# EAGLE design main (EAGLE 8.3.1)
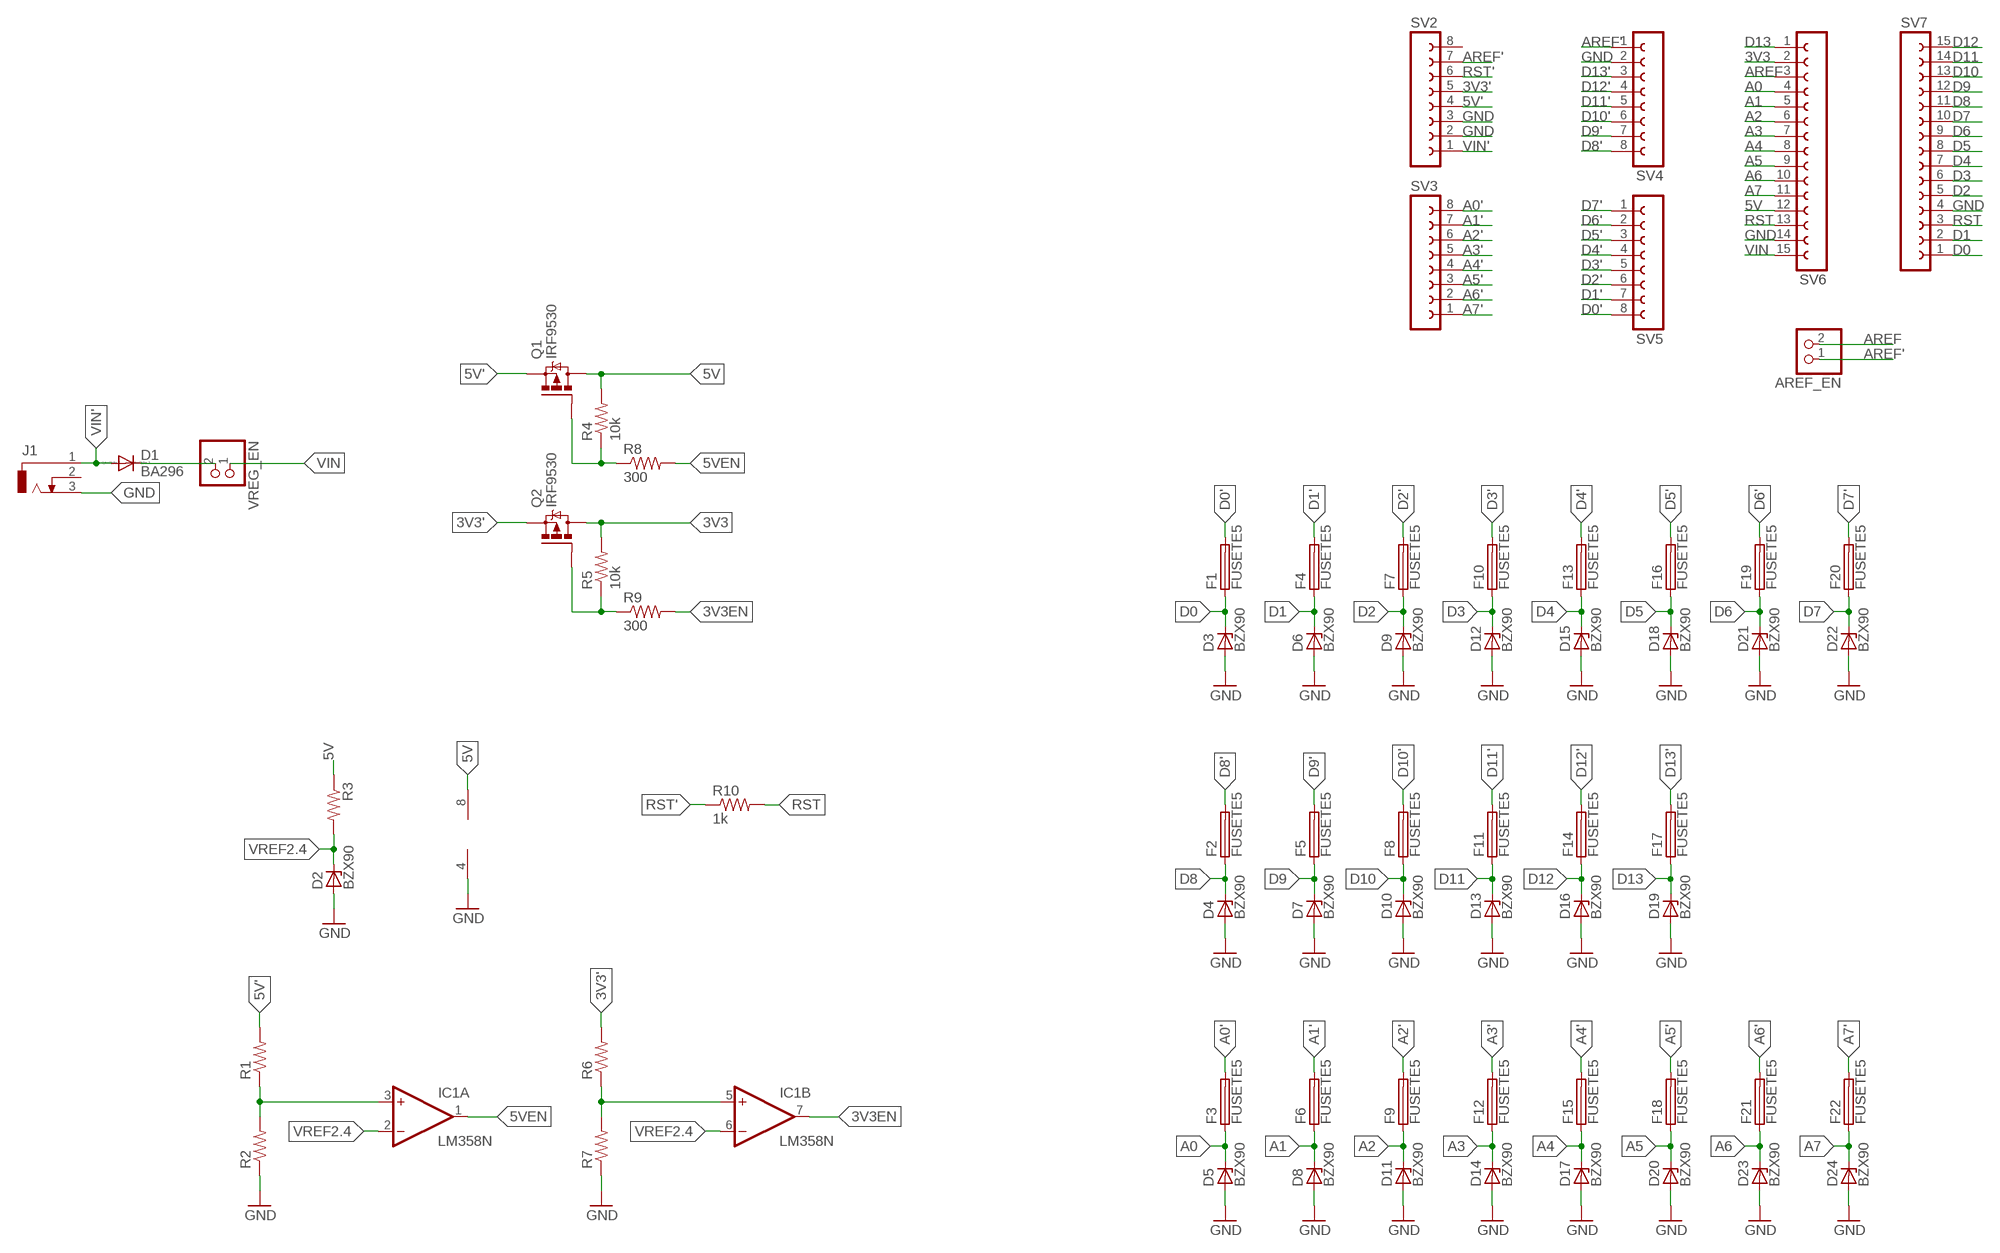
[diagram p0: schematic, sheet 1]

## Parts
AREF_EN  PINHD-1X2  [1X02]
D1  BA296  [P2-15]
D2  BZX90  [DO34Z7]
D3  BZX90  [DO34Z7]
D4  BZX90  [DO34Z7]
D5  BZX90  [DO34Z7]
D6  BZX90  [DO34Z7]
D7  BZX90  [DO34Z7]
D8  BZX90  [DO34Z7]
D9  BZX90  [DO34Z7]
D10  BZX90  [DO34Z7]
D11  BZX90  [DO34Z7]
D12  BZX90  [DO34Z7]
D13  BZX90  [DO34Z7]
D14  BZX90  [DO34Z7]
D15  BZX90  [DO34Z7]
D16  BZX90  [DO34Z7]
D17  BZX90  [DO34Z7]
D18  BZX90  [DO34Z7]
D19  BZX90  [DO34Z7]
D20  BZX90  [DO34Z7]
D21  BZX90  [DO34Z7]
D22  BZX90  [DO34Z7]
D23  BZX90  [DO34Z7]
D24  BZX90  [DO34Z7]
F1  FUSETE5  [TE5]
F2  FUSETE5  [TE5]
F3  FUSETE5  [TE5]
F4  FUSETE5  [TE5]
F5  FUSETE5  [TE5]
F6  FUSETE5  [TE5]
F7  FUSETE5  [TE5]
F8  FUSETE5  [TE5]
F9  FUSETE5  [TE5]
F10  FUSETE5  [TE5]
F11  FUSETE5  [TE5]
F12  FUSETE5  [TE5]
F13  FUSETE5  [TE5]
F14  FUSETE5  [TE5]
F15  FUSETE5  [TE5]
F16  FUSETE5  [TE5]
F17  FUSETE5  [TE5]
F18  FUSETE5  [TE5]
F19  FUSETE5  [TE5]
F20  FUSETE5  [TE5]
F21  FUSETE5  [TE5]
F22  FUSETE5  [TE5]
IC1  LM358N  [DIL08]
J1  DCJ0303  [DCJ0303]
Q1  IRF9530  [TO220BV]
Q2  IRF9530  [TO220BV]
R1  R-US_0204/7  [0204/7]
R2  R-US_0204/7  [0204/7]
R3  R-US_0204/7  [0204/7]
R4  10k  R-US_0204/7  [0204/7]
R5  10k  R-US_0204/7  [0204/7]
R6  R-US_0204/7  [0204/7]
R7  R-US_0204/7  [0204/7]
R8  300  R-US_0204/7  [0204/7]
R9  300  R-US_0204/7  [0204/7]
R10  1k  R-US_0204/7  [0204/7]
SV2  FE08-1  [FE08]
SV3  FE08-1  [FE08]
SV4  FE08-1  [FE08]
SV5  FE08-1  [FE08]
SV6  FE15-1  [FE15]
SV7  FE15-1  [FE15]
VREG_EN  PINHD-1X2  [1X02]

## Nets
3V3: Q2.D R5.2 SV6.2
3V3': Q2.S R6.2 SV2.5
3V3EN: IC1.7(B:OUT) R9.2
5V: IC1.8(P:V+) Q1.D R3.1 R4.2 SV6.12
5V': Q1.S R1.2 SV2.4
5VEN: IC1.1(A:OUT) R8.2
A0: D5.C F3.1 SV6.4
A0': F3.2 SV3.8
A1: D8.C F6.1 SV6.5
A1': F6.2 SV3.7
A2: D11.C F9.1 SV6.6
A2': F9.2 SV3.6
A3: D14.C F12.1 SV6.7
A3': F12.2 SV3.5
A4: D17.C F15.1 SV6.8
A4': F15.2 SV3.4
A5: D20.C F18.1 SV6.9
A5': F18.2 SV3.3
A6: D23.C F21.1 SV6.10
A6': F21.2 SV3.2
A7: D24.C F22.1 SV6.11
A7': F22.2 SV3.1
AREF: AREF_EN.2 SV6.3
AREF': AREF_EN.1 SV2.7 SV4.1
D0: D3.C F1.1 SV7.1
D0': F1.2 SV5.8
D1: D6.C F4.1 SV7.2
D1': F4.2 SV5.7
D2: D9.C F7.1 SV7.5
D2': F7.2 SV5.6
D3: D12.C F10.1 SV7.6
D3': F10.2 SV5.5
D4: D15.C F13.1 SV7.7
D4': F13.2 SV5.4
D5: D18.C F16.1 SV7.8
D5': F16.2 SV5.3
D6: D21.C F19.1 SV7.9
D6': F19.2 SV5.2
D7: D22.C F20.1 SV7.10
D7': F20.2 SV5.1
D8: D4.C F2.1 SV7.11
D8': F2.2 SV4.8
D9: D7.C F5.1 SV7.12
D9': F5.2 SV4.7
D10: D10.C F8.1 SV7.13
D10': F8.2 SV4.6
D11: D13.C F11.1 SV7.14
D11': F11.2 SV4.5
D12: D16.C F14.1 SV7.15
D12': F14.2 SV4.4
D13: D19.C F17.1 SV6.1
D13': F17.2 SV4.3
GND: D2.A D3.A D4.A D5.A D6.A D7.A D8.A D9.A D10.A D11.A D12.A D13.A D14.A D15.A D16.A D17.A D18.A D19.A D20.A D21.A D22.A D23.A D24.A IC1.4(P:V-) J1.3 R2.1 R7.1 SV2.2 SV2.3 SV4.2 SV6.14 SV7.4
N$2: D1.C VREG_EN.2
N$3: Q2.G R5.1 R9.1
N$4: Q1.G R4.1 R8.1
N$6: IC1.3(A:+IN) R1.1 R2.2
N$7: IC1.5(B:+IN) R6.1 R7.2
RST: R10.2 SV6.13 SV7.3
RST': R10.1 SV2.6
VIN: SV6.15 VREG_EN.1
VIN': D1.A J1.1 SV2.1
VREF2.4: D2.C IC1.2(A:-IN) IC1.6(B:-IN) R3.2
Unconnected: J1.2 SV2.8

## Library data of the parts
AREF_EN VREG_EN = pinhead:PINHD-1X2: PIN HEADER
D1 = diode:BA296: DIODE
D2-D24 = diode:BZX90: Z DIODE
F1-F22 = fuse:FUSE: Fuse; OC_FARNELL: unknown; OC_NEWARK: unknown
IC1 = linear:LM358: OP AMP also LM158; LM258; LM2904 Source: http://cache.national.com/ds/LM/LM158.pdf
J1 = con-jack:DCJ0303: DC POWER JACK Source: DCJ0303.pdf; OC_FARNELL: unknown; OC_NEWARK: unknown
Q1 Q2 = transistor-power:IRF9530: P-CHANNEL HEXFET POWER-MOS-FET Source: http://www.irf.com/product-info/datasheets/data/irf9530.pdf
R1-R10 = rcl:R-US_: RESISTOR, American symbol
SV2-SV5 = con-lsta:FE08-1: FEMALE HEADER; OC_FARNELL: unknown; OC_NEWARK: unknown
SV6 SV7 = con-lsta:FE15-1: FEMALE HEADER; OC_FARNELL: unknown; OC_NEWARK: unknown

## Board
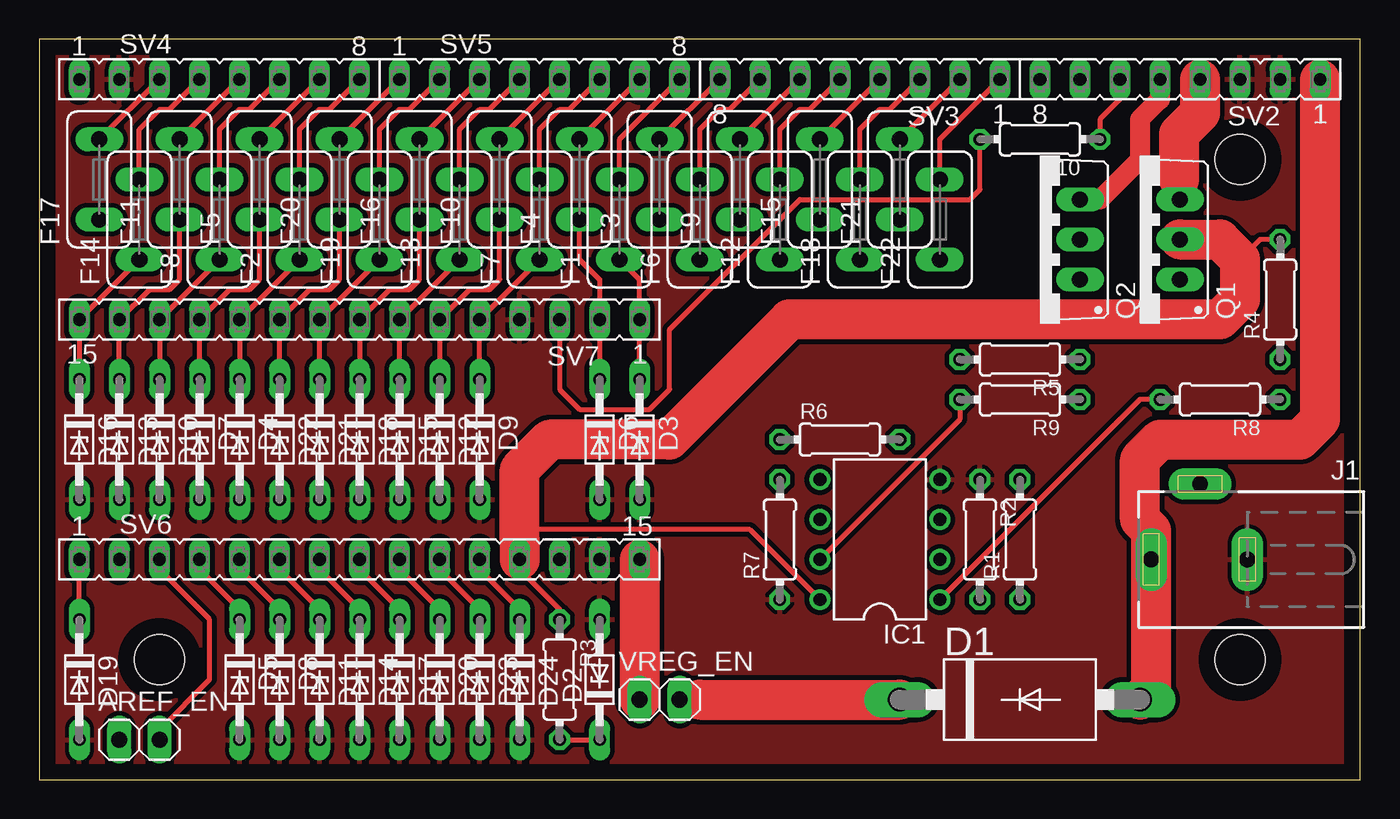
[diagram p1: board, top side]
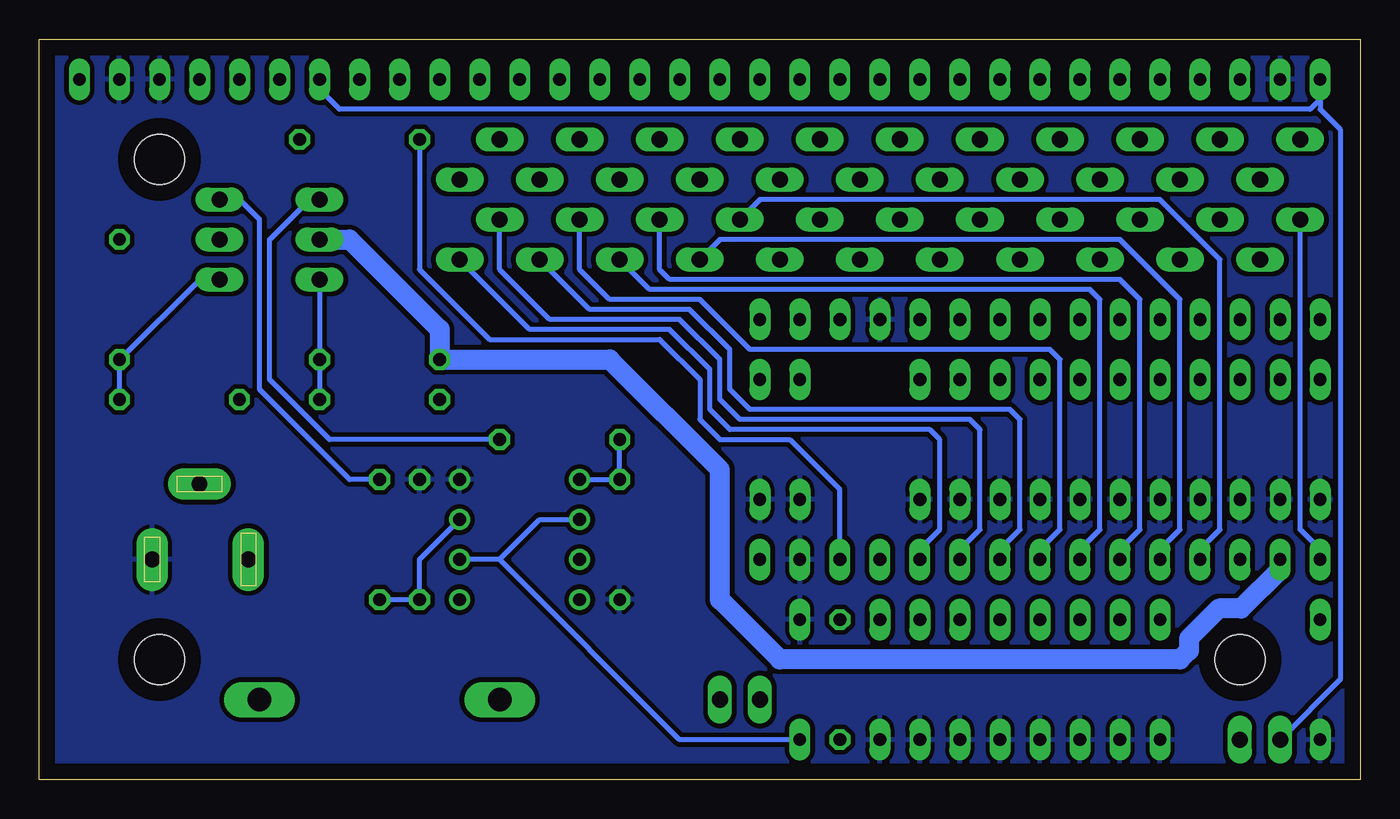
[diagram p2: board, bottom side, seen from below]

Size 83.82 x 46.99 mm. Coordinates in mm from the lower left corner, seen from the top.
Outline: 0,0 83.82,0 83.82,46.99 0,46.99 0,0
Copper layers (1*16): Top 0.035mm / dielectric 1.5mm / Bottom 0.035mm
Design rules "default": minimum track width 6mil, minimum drill 0.35mm, track to track 6mil, track to pad 6mil, pad to pad 6mil, via to via 6mil, smd to smd 6mil, copper to edge 40mil, drill to drill 6mil, minimum pad ring 10mil, minimum via ring 8mil, stop-mask expansion 4mil, vias tented up to drill 0mil, thermal gap 10mil
Holes 3.17 mm at 7.62,7.62 76.2,39.37 76.2,7.62

### Footprints (pad centres in the part's own frame; a part is rotated, then mirrored left to right if it is on the bottom)
1X02 = drill 1.016 long: 1 -1.27,0; 2 1.27,0
P2-15 = drill 1.499 long: A 7.62,0; C -7.62,0
DO34Z7 = drill 0.813 long: A 3.81,0; C -3.81,0
TE5 = drill 1.016 long: 1 -2.54,0; 2 2.54,0
DIL08 = drill 0.813 pad 1.27: 1 -3.81,-3.81; 2 -1.27,-3.81; 3 1.27,-3.81; 4 3.81,-3.81; 5 3.81,3.81; 6 1.27,3.81; 7 -1.27,3.81; 8 -3.81,3.81
DCJ0303 = drill 1 pad 2 long: 1 0,3.1; 2 4.8,0; 3 0,-3
TO220BV = drill 1.016 long: D 0,-2.54; G -2.54,-2.54; S 2.54,-2.54
0204/7 = drill 0.813 octagon: 1 -3.81,0; 2 3.81,0
FE08 = drill 0.813 long: 1 -8.89,0; 2 -6.35,0; 3 -3.81,0; 4 -1.27,0; 5 1.27,0; 6 3.81,0; 7 6.35,0; 8 8.89,0
FE15 = drill 0.813 long: 1 -17.78,0; 2 -15.24,0; 3 -12.7,0; 4 -10.16,0; 5 -7.62,0; 6 -5.08,0; 7 -2.54,0; 8 0,0; 9 2.54,0; 10 5.08,0; 11 7.62,0; 12 10.16,0; 13 12.7,0; 14 15.24,0; 15 17.78,0

### Placement (x,y rotation side)
AREF_EN  6.35,2.54 0 top
D1  62.23,5.08 0 top
D2  35.56,6.35 90 top
D3  38.1,21.59 270 top
D4  12.7,21.59 270 top
D5  12.7,6.35 270 top
D6  35.56,21.59 270 top
D7  10.16,21.59 270 top
D8  15.24,6.35 270 top
D9  27.94,21.59 270 top
D10  7.62,21.59 270 top
D11  17.78,6.35 270 top
D12  25.4,21.59 270 top
D13  5.08,21.59 270 top
D14  20.32,6.35 270 top
D15  22.86,21.59 270 top
D16  2.54,21.59 270 top
D17  22.86,6.35 270 top
D18  20.32,21.59 270 top
D19  2.54,6.35 270 top
D20  25.4,6.35 270 top
D21  17.78,21.59 270 top
D22  15.24,21.59 270 top
D23  27.94,6.35 270 top
D24  30.48,6.35 270 top
F1  36.83,35.56 90 top
F2  16.51,35.56 90 top
F3  39.37,38.1 90 top
F4  34.29,38.1 90 top
F5  13.97,38.1 90 top
F6  41.91,35.56 90 top
F7  31.75,35.56 90 top
F8  11.43,35.56 90 top
F9  44.45,38.1 90 top
F10  29.21,38.1 90 top
F11  8.89,38.1 90 top
F12  46.99,35.56 90 top
F13  26.67,35.56 90 top
F14  6.35,35.56 90 top
F15  49.53,38.1 90 top
F16  24.13,38.1 90 top
F17  3.81,38.1 90 top
F18  52.07,35.56 90 top
F19  21.59,35.56 90 top
F20  19.05,38.1 90 top
F21  54.61,38.1 90 top
F22  57.15,35.56 90 top
IC1  53.34,15.24 90 top
J1  73.66,13.97 90 top
Q1  69.85,34.29 90 top
Q2  63.5,34.29 90 top
R1  62.23,15.24 90 top
R2  59.69,15.24 270 top
R3  33.02,6.35 270 top
R4  78.74,30.48 90 top
R5  62.23,26.67 180 top
R6  50.8,21.59 0 top
R7  46.99,15.24 90 top
R8  74.93,24.13 180 top
R9  62.23,24.13 180 top
R10  63.5,40.64 180 top
SV2  72.39,44.45 180 top
SV3  52.07,44.45 180 top
SV4  11.43,44.45 0 top
SV5  31.75,44.45 0 top
SV6  20.32,13.97 0 top
SV7  20.32,29.21 180 top
VREG_EN  39.37,5.08 0 top

### Tracks (layer width: path | path; a pad name or v marks a point on that pad's centre or on a via)
3V3
  Bottom 1.27: SV6.2 5.08,13.34 7.56,10.86 8.96,10.86 10.86,8.96 10.86,8.19 11.43,7.62 36.83,7.62 40.64,11.43 40.64,19.68 47.62,26.67 R5.2 58.42,28.57 64.13,34.29 Q2.D
3V3'
  Top 1.27: SV2.5 71.12,43.18 69.85,41.91 69.85,39.37 67.31,36.83 Q2.S
  Bottom 0.305: R6.2 65.41,21.59 69.22,25.4 69.22,34.29 66.68,36.83 Q2.S
3V3EN
  Top 0.305: R9.2 58.42,22.86 IC1.7
5V
  Top 0.305: SV6.12 30.48,13.34 33.02,10.79 R3.1 | R4.2 77.47,34.29 76.2,33.02 | IC1.8 45.09,15.88 31.16,15.88 30.48,15.19
  Top 2.54: SV6.12 30.48,15.19 30.48,19.68 32.38,21.59 39.98,21.59 47.6,29.21 74.93,29.21 76.2,30.48 76.2,33.02 74.93,34.29 Q1.D
5V'
  Top 1.27: 72.33,38.1 72.33,36.89 Q1.S
  Top 2.54: SV2.4 73.66,42.31 72.33,40.97 72.33,38.1
  Bottom 0.305: Q1.S 71.12,36.83 69.85,35.56 69.85,24.77 64.13,19.05 R1.2
5VEN
  Top 0.305: R8.2 69.85,24.13 IC1.1
A0
  Top 0.305: SV6.4 10.16,13.34 12.7,10.79 D5.C
  Bottom 0.305: SV6.4 10.16,14.61 8.89,15.88 8.89,33.02 12.7,36.83 38.1,36.83 F3.1
A0'
  Top 0.305: F3.2 SV3.8
A1
  Top 0.305: SV6.5 12.7,13.34 15.24,10.79 D8.C
  Bottom 0.305: SV6.5 12.7,14.61 11.43,15.88 11.43,30.48 15.24,34.29 40.64,34.29 F6.1
A1'
  Top 0.305: F6.2 41.91,41.27 43.18,42.55 43.82,42.55 SV3.7
A2
  Top 0.305: D11.C 17.78,10.79 15.24,13.34 SV6.6
  Bottom 0.305: SV6.6 15.24,14.61 13.97,15.88 13.97,30.48 15.24,31.75 43.82,31.75 44.45,32.38 F9.1
A2'
  Top 0.305: F9.2 SV3.6
A3
  Top 0.305: SV6.7 17.78,13.34 20.32,10.79 D14.C
  Bottom 0.305: SV6.7 17.78,14.61 16.51,15.88 16.51,30.48 17.15,31.11 45.09,31.11 F12.1
A3'
  Top 0.305: F12.2 46.99,41.27 48.26,42.55 48.9,42.55 SV3.5
A4
  Top 0.305: SV6.8 20.32,13.34 22.86,10.79 D17.C
  Bottom 0.305: SV6.8 20.32,14.61 19.05,15.88 19.05,26.67 19.69,27.3 38.73,27.3 41.91,30.48 47.62,30.48 49.53,32.38 F15.1
A4'
  Top 0.305: F15.2 SV3.4
A5
  Top 0.305: D20.C 25.4,10.79 22.86,13.34 SV6.9
  Bottom 0.305: SV6.9 22.86,14.61 21.59,15.88 21.59,22.86 22.23,23.5 38.73,23.5 40.01,24.77 40.01,27.3 42.55,29.84 48.9,29.84 F18.1
A5'
  Top 0.305: F18.2 52.07,41.27 53.34,42.55 53.98,42.55 SV3.3
A6
  Top 0.305: SV6.10 25.4,13.34 27.94,10.79 D23.C
  Bottom 0.305: SV6.10 25.4,14.61 24.13,15.88 24.13,22.23 24.77,22.86 39.37,22.86 40.64,24.13 40.64,26.67 43.18,29.21 51.43,29.21 54.61,32.38 F21.1
A6'
  Top 0.305: F21.2 SV3.2
A7
  Top 0.305: SV6.11 27.94,13.34 30.48,10.79 D24.C
  Bottom 0.305: SV6.11 27.94,14.61 26.67,15.88 26.67,21.59 27.3,22.23 40.01,22.23 41.27,23.5 41.27,26.04 43.82,28.57 52.71,28.57 F22.1
A7'
  Top 0.305: F22.2 57.15,40.64 SV3.1
AREF
  Top 0.305: SV6.3 7.62,13.34 10.79,10.16 10.79,6.35 7.62,3.17 AREF_EN.2
AREF'
  Bottom 0.305: SV2.7 66.04,43.81 64.77,42.55 3.18,42.55 2.54,43.18 SV4.1 2.54,42.55 1.27,41.27 1.27,6.35 AREF_EN.1
D0
  Top 0.305: F1.1 38.1,31.75 SV7.1 D3.C
D0'
  Top 0.305: F1.2 36.83,40.64 SV5.8
D1
  Top 0.305: F4.1 34.29,33.02 35.56,31.75 SV7.2 D6.C
D1'
  Top 0.305: F4.2 SV5.7
D2
  Top 0.305: F7.1 SV7.5 D9.C
D2'
  Top 0.305: F7.2 31.75,41.27 33.02,42.55 33.66,42.55 SV5.6
D3
  Top 0.305: F10.1 29.21,31.75 28.58,31.11 27.3,31.11 SV7.6 D12.C
D3'
  Top 0.305: F10.2 SV5.5
D4
  Top 0.305: F13.1 SV7.7 D15.C
D4'
  Top 0.305: F13.2 26.67,41.27 27.94,42.55 28.58,42.55 SV5.4
D5
  Top 0.305: F16.1 24.13,31.75 23.49,31.11 22.23,31.11 SV7.8 D18.C
D5'
  Top 0.305: F16.2 SV5.3
D6
  Top 0.305: F19.1 SV7.9 D21.C
D6'
  Top 0.305: F19.2 21.59,41.27 22.86,42.55 23.49,42.55 SV5.2
D7
  Top 0.305: F20.1 19.05,31.75 18.41,31.11 17.15,31.11 SV7.10 D22.C
D7'
  Top 0.305: F20.2 SV5.1
D8
  Top 0.305: F2.1 SV7.11 D4.C
D8'
  Top 0.305: F2.2 16.51,41.27 17.78,42.55 18.41,42.55 SV4.8
D9
  Top 0.305: F5.1 13.97,31.75 13.34,31.11 12.06,31.11 SV7.12 D7.C
D9'
  Top 0.305: F5.2 SV4.7
D10
  Top 0.305: F8.1 SV7.13 D10.C
D10'
  Top 0.305: F8.2 11.43,41.27 12.7,42.55 13.34,42.55 SV4.6
D11
  Top 0.305: F11.1 8.89,31.75 8.25,31.11 6.98,31.11 SV7.14 D13.C
D11'
  Top 0.305: F11.2 SV4.5
D12
  Top 0.305: F14.1 SV7.15 D16.C
D12'
  Top 0.305: F14.2 6.35,41.27 7.62,42.55 8.25,42.55 SV4.4
D13
  Top 0.305: D19.C SV6.1
  Bottom 0.305: SV6.1 2.54,14.61 3.81,15.88 F17.1
D13'
  Top 0.305: F17.2 SV4.3
GND
  pour Top (isolate 0.305): 0,46.99 0,0 83.82,0 83.82,46.99
  pour Bottom (isolate 0.305): 0,46.99 0,0 83.82,0 83.82,46.99
N$2
  Top 1.27: VREG_EN.2 41.91,5.08
  Top 2.54: 41.91,5.08 D1.C
N$3
  Bottom 0.305: Q2.G R5.1 R9.1
N$4
  Bottom 0.305: 78.74,26.64 R4.1 | 78.74,26.64 R8.1 | Q1.G 73.62,31.75 78.74,26.64
N$6
  Bottom 0.305: R1.1 R2.2 59.69,13.97 IC1.3
N$7
  Bottom 0.305: IC1.5 R7.2 R6.1
RST
  Top 0.305: SV7.3 33.02,24.77 34.29,23.5 38.73,23.5 40.01,24.77 40.01,28.57 48.26,36.83 59.05,36.83 59.69,37.47 R10.2
  Bottom 0.305: SV6.13 33.02,18.41 36.2,21.59 40.64,21.59 41.91,22.86 41.91,25.4 44.45,27.94 55.24,27.94 59.69,32.38 R10.2
RST'
  Top 0.305: SV2.6 68.58,43.18 67.31,41.91 R10.1
VIN
  Top 2.54: SV6.15 VREG_EN.1
VIN'
  Top 2.54: D1.A 70.56,5.79 J1.1 70.56,15.8 69.85,16.51 69.85,20.32 71.12,21.59 80.01,21.59 81.28,22.86 SV2.1
VREF2.4
  Top 0.305: R3.2 D2.C
  Bottom 0.305: 54.61,13.97 IC1.2 | IC1.6 52.07,16.51 54.61,13.97 | D2.C 43.18,2.54 54.61,13.97